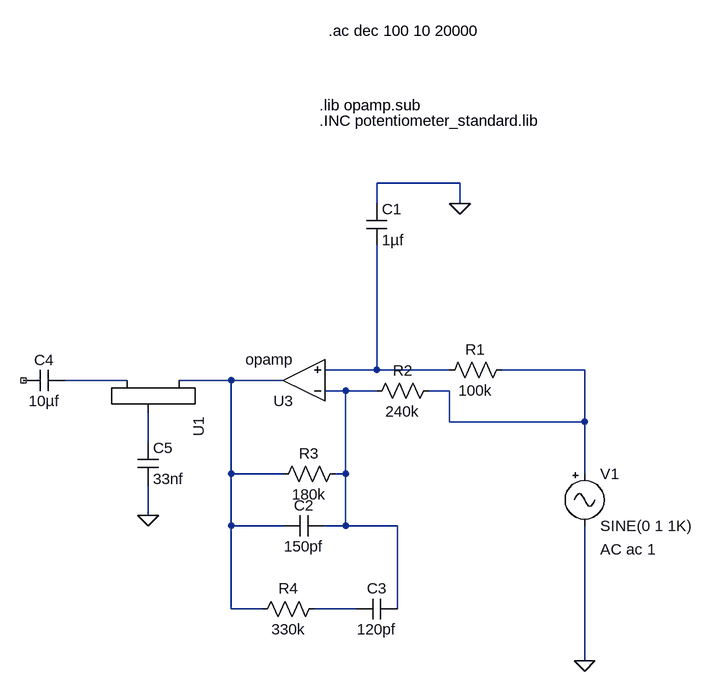
[diagram p0: schematic Draft1.asc]
Draft1.asc, the LTspice schematic file:
Version 4
SHEET 1 880 680
WIRE -672 -208 -800 -208
WIRE -800 -176 -800 -208
WIRE -672 -176 -672 -208
WIRE -800 80 -800 -112
WIRE -800 80 -880 80
WIRE -688 80 -800 80
WIRE -480 80 -608 80
WIRE -1184 96 -1280 96
WIRE -1024 96 -1104 96
WIRE -944 96 -1024 96
WIRE -848 112 -880 112
WIRE -800 112 -848 112
WIRE -688 112 -720 112
WIRE -688 160 -688 112
WIRE -480 160 -480 80
WIRE -480 160 -688 160
WIRE -1152 192 -1152 144
WIRE -1024 240 -1024 96
WIRE -944 240 -1024 240
WIRE -848 240 -848 112
WIRE -848 240 -864 240
WIRE -480 240 -480 160
WIRE -1152 304 -1152 256
WIRE -1024 320 -1024 240
WIRE -944 320 -1024 320
WIRE -848 320 -848 240
WIRE -848 320 -880 320
WIRE -768 320 -848 320
WIRE -1024 448 -1024 320
WIRE -976 448 -1024 448
WIRE -832 448 -896 448
WIRE -768 448 -768 320
WIRE -480 528 -480 320
FLAG -672 -176 0
FLAG -480 528 0
FLAG -1152 304 0
SYMBOL Misc\\signal -480 224 R0
WINDOW 123 24 132 Left 2
WINDOW 39 0 0 Left 0
SYMATTR InstName V1
SYMATTR Value2 AC ac 1
SYMBOL res -592 64 R90
WINDOW 0 0 56 VBottom 2
WINDOW 3 32 56 VTop 2
SYMATTR InstName R1
SYMATTR Value 100k
SYMBOL Opamps\\opamp -912 160 R180
SYMATTR InstName U3
SYMBOL cap -816 -176 R0
SYMATTR InstName C1
SYMATTR Value 1µf
SYMBOL res -704 96 R90
WINDOW 0 0 56 VBottom 2
WINDOW 3 32 56 VTop 2
SYMATTR InstName R2
SYMATTR Value 240k
SYMBOL res -848 224 R90
WINDOW 0 0 56 VBottom 2
WINDOW 3 32 56 VTop 2
SYMATTR InstName R3
SYMATTR Value 180k
SYMBOL cap -880 304 R90
WINDOW 0 0 32 VBottom 2
WINDOW 3 32 32 VTop 2
SYMATTR InstName C2
SYMATTR Value 150pf
SYMBOL res -880 432 R90
WINDOW 0 0 56 VBottom 2
WINDOW 3 32 56 VTop 2
SYMATTR InstName R4
SYMATTR Value 330k
SYMBOL cap -768 432 R90
WINDOW 0 0 32 VBottom 2
WINDOW 3 32 32 VTop 2
SYMATTR InstName C3
SYMATTR Value 120pf
SYMBOL cap -1280 80 R90
WINDOW 0 0 32 VBottom 2
WINDOW 3 32 32 VTop 2
SYMATTR InstName C4
SYMATTR Value 10µf
SYMBOL cap -1168 192 R0
SYMATTR InstName C5
SYMATTR Value 33nf
SYMBOL potentiometer_standard -1088 80 R90
SYMATTR InstName U1
TEXT -888 -328 Left 2 !.lib opamp.sub
TEXT -888 -304 Left 2 !.INC potentiometer_standard.lib
TEXT -874 -442 Left 2 !.ac dec 100 10 20000

The netlist it stands for:
* Draft1.asc
V1 N002 0 SINE(0 1 1K) AC ac 1
R1 N002 N001 100k
XU3 N005 N001 N004 opamp Aol=100K GBW=10Meg  ; pins invin noninvin out
C1 0 N001 1µf
R2 N002 N005 240k
R3 N005 N004 180k
C2 N005 N004 150pf
R4 N007 N004 330k
C3 N005 N007 120pf
C4 N003 NC_01 10µf
C5 N006 0 33nf
XU1 N004 N003 N006 potentiometer_standard
.lib opamp.sub
.INC potentiometer_standard.lib
.ac dec 100 10 20000
.backanno
.end